# Altium project display.PrjPCB
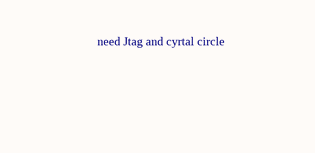
[diagram p0: icm+cpld.SchDoc, top right]
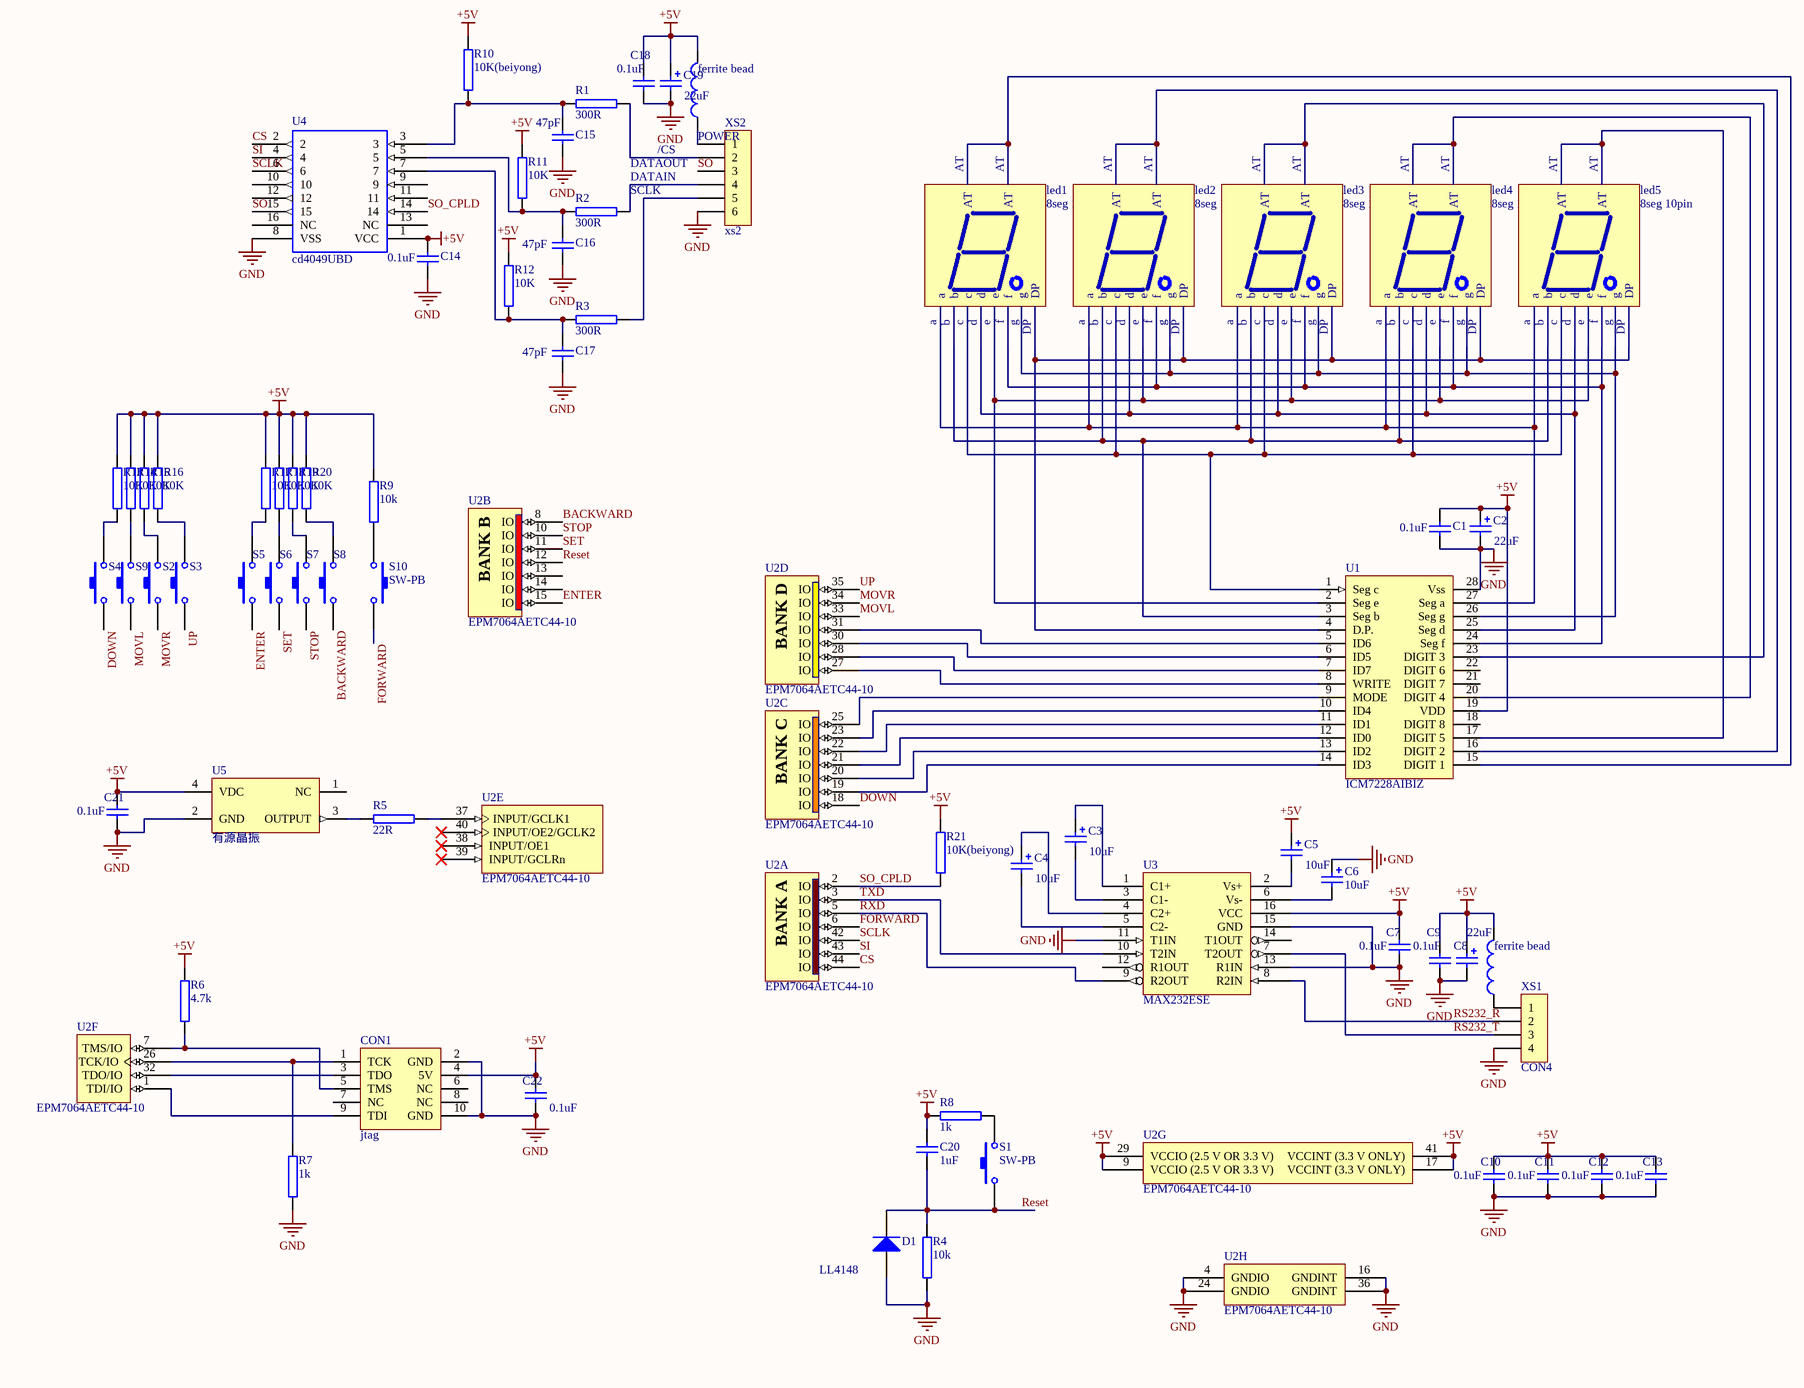
[diagram p1: icm+cpld.SchDoc, bottom left]
1 sheet, 69 parts. Net scope: global (net labels, ports and power ports of the same name join across sheets).
Board file: display.PcbDoc

## Sheet icm+cpld.SchDoc
size A3

### Parts
C1  value 0.1uF  [0805]  (hidden comment: Cap)
C2  22uF  [7343]
C3  10uF  [C1206]
C4  value 10uF  [C1206]  (hidden comment: 22uF)
C5  10uF  [C1206]
C6  10uF  [C1206]
C7  value 0.1uF  [0805]  (hidden comment: Cap)
C8  22uF  [7343]
C9  value 0.1uF  [0805]  (hidden comment: Cap)
C10  value 0.1uF  [0805]  (hidden comment: Cap)
C11  value 0.1uF  [0805]  (hidden comment: Cap)
C12  value 0.1uF  [0805]  (hidden comment: Cap)
C13  value 0.1uF  [0805]  (hidden comment: Cap)
C14  value 0.1uF  [0805]  (hidden comment: Cap)
C15  value 47pF  [0805]  (hidden comment: Cap)
C16  value 47pF  [0805]  (hidden comment: Cap)
C17  value 47pF  [0805]  (hidden comment: Cap)
C18  value 0.1uF  [0805]  (hidden comment: Cap)
C19  22uF  [7343]
C20  value 1uF  [1206]  (hidden comment: Cap)
C21  value 0.1uF  [0805]  (hidden comment: Cap)
C22  value 0.1uF  [0805]  (hidden comment: Cap)
CON1  jtag  [HDR2X5]
D1  LL4148  [DO214]
L1  ferrite bead  [0805]
L2  ferrite bead  [0805]
led1  8seg 10pin  [LEDsum]
led2  8seg 10pin  [LEDsum]
led3  8seg 10pin  [LEDsum]
led4  8seg 10pin  [LEDsum]
led5  8seg 10pin  [LEDsum]
R1  300R  [0805]
R2  300R  [0805]
R3  300R  [0805]
R4  10k  [0805]
R5  22R  [0805]
R6  4.7k  [0805]
R7  1k  [0805]
R8  1k  [0805]
R9  10k  [0805]
R10  10K(beiyong)  [0805]
R11  10K  [0805]
R12  10K  [0805]
R13  10K  [0805]
R14  10K  [0805]
R15  10K  [0805]
R16  10K  [0805]
R17  10K  [0805]
R18  10K  [0805]
R19  10K  [0805]
R20  10K  [0805]
R21  10K(beiyong)  [0805]
S1  SW-PB  [reset]
S2  SW-PB  [B3F4050]  (value not drawn)
S3  SW-PB  [B3F4050]  (value not drawn)
S4  SW-PB  [B3F4050]  (value not drawn)
S5  SW-PB  [B3F4050]  (value not drawn)
S6  SW-PB  [B3F4050]  (value not drawn)
S7  SW-PB  [B3F4050]  (value not drawn)
S8  SW-PB  [B3F4050]  (value not drawn)
S9  SW-PB  [B3F4050]  (value not drawn)
S10  SW-PB  [B3F4050]
U1  ICM7228AIBIZ  [SO28_L]
U2  EPM7064AETC44-10  [TQFP44_N]  (parts A,B,C,D,E,F,G,H of 8)
U3  MAX232ESE  [NSO16_N]
U4  cd4049UBD  [L16_N]
U5  有源晶振  [smd7050]
XS1  CON4  [2SIP4]
XS2  xs2  [SIP6]

### Nets
+5V: C1.2 C2.1 C5.1 C7.2 C8.1 C9.2 C10.2 C11.2 C12.2 C13.2 C14.2 C18.2 C19.1 C20.1 C21.2 C22.2 CON1.4(5V) L1.1 L2.1 R6.1 R8.2 R9.1 R10.2 R11.2 R12.2 R13.2 R14.2 R15.2 R16.2 R17.2 R18.2 R19.2 R20.2 R21.2 U1.19(VDD) U2.9(VCCIO_(2.5_V_OR_3.3_V)) U2.17(VCCINT_(3.3_V_ONLY)) U2.29(VCCIO_(2.5_V_OR_3.3_V)) U2.41(VCCINT_(3.3_V_ONLY)) U3.16(VCC) U4.1(VCC) U5.4(VDC)
GND: C1.1 C2.2 C6.1 C7.1 C8.2 C9.1 C10.1 C11.1 C12.1 C13.1 C14.1 C15.1 C16.1 C17.1 C18.1 C19.2 C21.1 C22.1 CON1.2(GND) CON1.10(GND) D1.1(A) R4.1 R7.2 U1.28(Vss) U2.4(GNDIO) U2.16(GNDINT) U2.24(GNDIO) U2.36(GNDINT) U3.11(T1IN) U3.13(R1IN) U3.15(GND) U4.8(VSS) U5.2(GND) XS1.4 XS2.6
BACKWARD: S8.1 U2.8(IO)
CS: U2.44(IO) U4.2
DOWN: S4.1 U2.18(IO)
ENTER: S5.1 U2.15(IO)
FORWARD: S10.2 U2.6(IO)
MOVL: S9.1 U2.33(IO)
MOVR: S2.1 U2.34(IO)
Reset: C20.2 D1.2(K) R4.2 S1.1 U2.12(IO)
RS232_R: U3.8(R2IN) XS1.2
RS232_T: U3.7(T2OUT) XS1.3
RXD: U2.5(IO) U3.9(R2OUT)
SCLK: U2.42(IO) U4.6
SET: S6.1 U2.11(IO)
SI: U2.43(IO) U4.4
SO: U4.15 XS2.3
SO_CPLD: R21.1 U2.2(IO) U4.14
STOP: S7.1 U2.10(IO)
TXD: U2.3(IO) U3.10(T2IN)
UP: S3.1 U2.35(IO)
NetC3_1: C3.1 U3.1(C1+)
NetC3_2: C3.2 U3.3(C1-)
NetC4_1: C4.1 U3.4(C2+)
NetC4_2: C4.2 U3.5(C2-)
NetC5_2: C5.2 U3.2(Vs+)
NetC6_2: C6.2 U3.6(Vs-)
NetC15_2: C15.2 R1.1 R10.1 U4.3
NetC16_2: C16.2 R2.1 R11.1 U4.5
NetC17_2: C17.2 R3.1 R12.1 U4.7
NetCON1_1: CON1.1(TCK) R7.1 U2.26(TCK/IO)
NetCON1_3: CON1.3(TDO) U2.32(TDO/IO)
NetCON1_5: CON1.5(TMS) R6.2 U2.7(TMS/IO)
NetCON1_9: CON1.9(TDI) U2.1(TDI/IO)
NetL1_2: L1.2 XS1.1
NetL2_2: L2.2 XS2.1
Netled1_a: led1.a led2.a led3.a led4.a led5.a U1.27(Seg_a)
Netled1_AT: led1.AT U1.15(DIGIT_1)
Netled1_b: led1.b led2.b led3.b led4.b led5.b U1.3(Seg_b)
Netled1_c: led1.c led2.c led3.c led4.c led5.c U1.1(Seg_c)
Netled1_d: led1.d led2.d led3.d led4.d led5.d U1.25(Seg_d)
Netled1_DP: led1.DP led2.DP led3.DP led4.DP led5.DP U1.4(D.P.)
Netled1_e: led1.e led2.e led3.e led4.e led5.e U1.2(Seg_e)
Netled1_f: led1.f led2.f led3.f led4.f led5.f U1.24(Seg_f)
Netled1_g: led1.g led2.g led3.g led4.g led5.g U1.26(Seg_g)
Netled2_AT: led2.AT U1.16(DIGIT_2)
Netled3_AT: led3.AT U1.23(DIGIT_3)
Netled4_AT: led4.AT U1.20(DIGIT_4)
Netled5_AT: led5.AT U1.17(DIGIT_5)
NetR1_2: R1.2 XS2.2
NetR2_2: R2.2 XS2.4
NetR3_2: R3.2 XS2.5
NetR5_1: R5.1 U2.37(INPUT/GCLK1)
NetR5_2: R5.2 U5.3(OUTPUT)
NetR8_1: R8.1 S1.2
NetR9_2: R9.2 S10.1
NetR13_1: R13.1 S4.2
NetR14_1: R14.1 S9.2
NetR15_1: R15.1 S2.2
NetR16_1: R16.1 S3.2
NetR17_1: R17.1 S5.2
NetR18_1: R18.1 S6.2
NetR19_1: R19.1 S7.2
NetR20_1: R20.1 S8.2
NetU1_5: U1.5(ID6) U2.31(IO)
NetU1_6: U1.6(ID5) U2.30(IO)
NetU1_7: U1.7(ID7) U2.28(IO)
NetU1_8: U1.8(WRITE) U2.27(IO)
NetU1_9: U1.9(MODE) U2.25(IO)
NetU1_10: U1.10(ID4) U2.23(IO)
NetU1_11: U1.11(ID1) U2.22(IO)
NetU1_12: U1.12(ID0) U2.21(IO)
NetU1_13: U1.13(ID2) U2.20(IO)
NetU1_14: U1.14(ID3) U2.19(IO)

Not connected (* = marked no-connect by the designer): CON1 6(NC) 7(NC) 8(NC); U1 18(DIGIT_8) 21(DIGIT_7) 22(DIGIT_6); U2 13(IO) 14(IO) 38(INPUT/OE1)* 39(INPUT/GCLRn)* 40(INPUT/OE2/GCLK2)*; U3 12(R1OUT) 14(T1OUT); U4 9 10 11 12 13(NC) 16(NC); U5 1(NC)

### Notes on the sheet
- need Jtag and cyrtal circle
- (near XS2) POWER
- DATAOUT
- (near R2) DATAIN
- (near R2) SCLK
- /CS
- (in symbol EPM7064AETC44-10, part A) BANK A
- (in symbol EPM7064AETC44-10, part B) BANK B
- (in symbol EPM7064AETC44-10, part C) BANK C
- (in symbol EPM7064AETC44-10, part D) BANK D

### Library data of the parts
C1 C7 C9-C18 C20-C22 = Cap: Capacitor; Published: 8-Jun-2000; LatestRevisionDate: 17-Jul-2002; LatestRevisionNote: Re-released for DXP Platform.; PackageReference: RAD-0.3; Publisher: Altium Limited
C2-C6 C8 C19 = Cap Pol2: Polarized Capacitor (Axial); Published: 8-Jun-2000; LatestRevisionDate: 17-Jul-2002; LatestRevisionNote: Re-released for DXP Platform.; PackageReference: POLAR0.8; Publisher: Altium Limited
  C2 C8 C19: Value: 22uF
  C3 C5 C6: Value: 10uF
D1 = Diode 1N4148: High Conductance Fast Diode; Published: 8-Jun-2000; LatestRevisionDate: 17-Jul-2002; LatestRevisionNote: Re-released for DXP Platform.; DatasheetVersion: 1997; PackageReference: DO-35; Publisher: Altium Limited; Code_JEDEC: DO-204-AH; ComponentLink1Description: Manufacturer Link; ComponentLink1URL: http://www.fairchildsemi.com/; ComponentLink2Description: Datasheet; ComponentLink2URL: http://www.fairchildsemi.com/ds/1N%2F1N4148.pdf
L1 L2 = INDUCTOR
R1-R21 = RES2
S1-S10 = SW-PB: Switch; Published: 24-Mar-1999; LatestRevisionDate: 17-Jul-2002; LatestRevisionNote: Re-released for DXP Platform.; PackageReference: SPST-2; Publisher: Altium Limited
U1 = ICM7218
U2 = EPM7064AETC44-10: MAX 7000AE 3.3V CPLD, 64 Macrocells, 44-Pin TQFP, Speed Grade 10, Commercial Grade; Published: 23-Sep-2002; LatestRevisionDate: 13-Apr-2006; LatestRevisionNote: IPC-7351 Footprint Added.; DatasheetVersion: ver4.5, Sep-2003; PackageVersion: ver14.3, Jul-2006; PackageReference: TQFP44; Publisher: Altium Limited; PackageDescription: 44-Pin Plastic Thin Quad Flat Pack (TFQP44); Supplier 1: Digi-Key; Supplier Part Number 1: 544-1191-ND; Code_JEDEC: MS-026-ACB; ComponentLink1Description: Manufacturer Link; ComponentLink1URL: http://www.altera.com/products/devices/max7k/m7k-index.html; ComponentLink2Description: Datasheet; ComponentLink2URL: http://www.altera.com/literature/ds/m7000a.pdf; ComponentLink3Description: Packaging Specification; ComponentLink3URL: http://www.altera.com/literature/ds/dspkg.pdf
U3 = MAX232: DUAL EIA-232 DRIVER/RECEIVER
U4 = cd4049
U5 = jingzhen
XS1 = CON4: Connector
XS2 = xs6